# EAGLE schematic OLM-jee-128 (EAGLE 6.4)
ABBREV: jn6; PROJECT: JeeNode v6
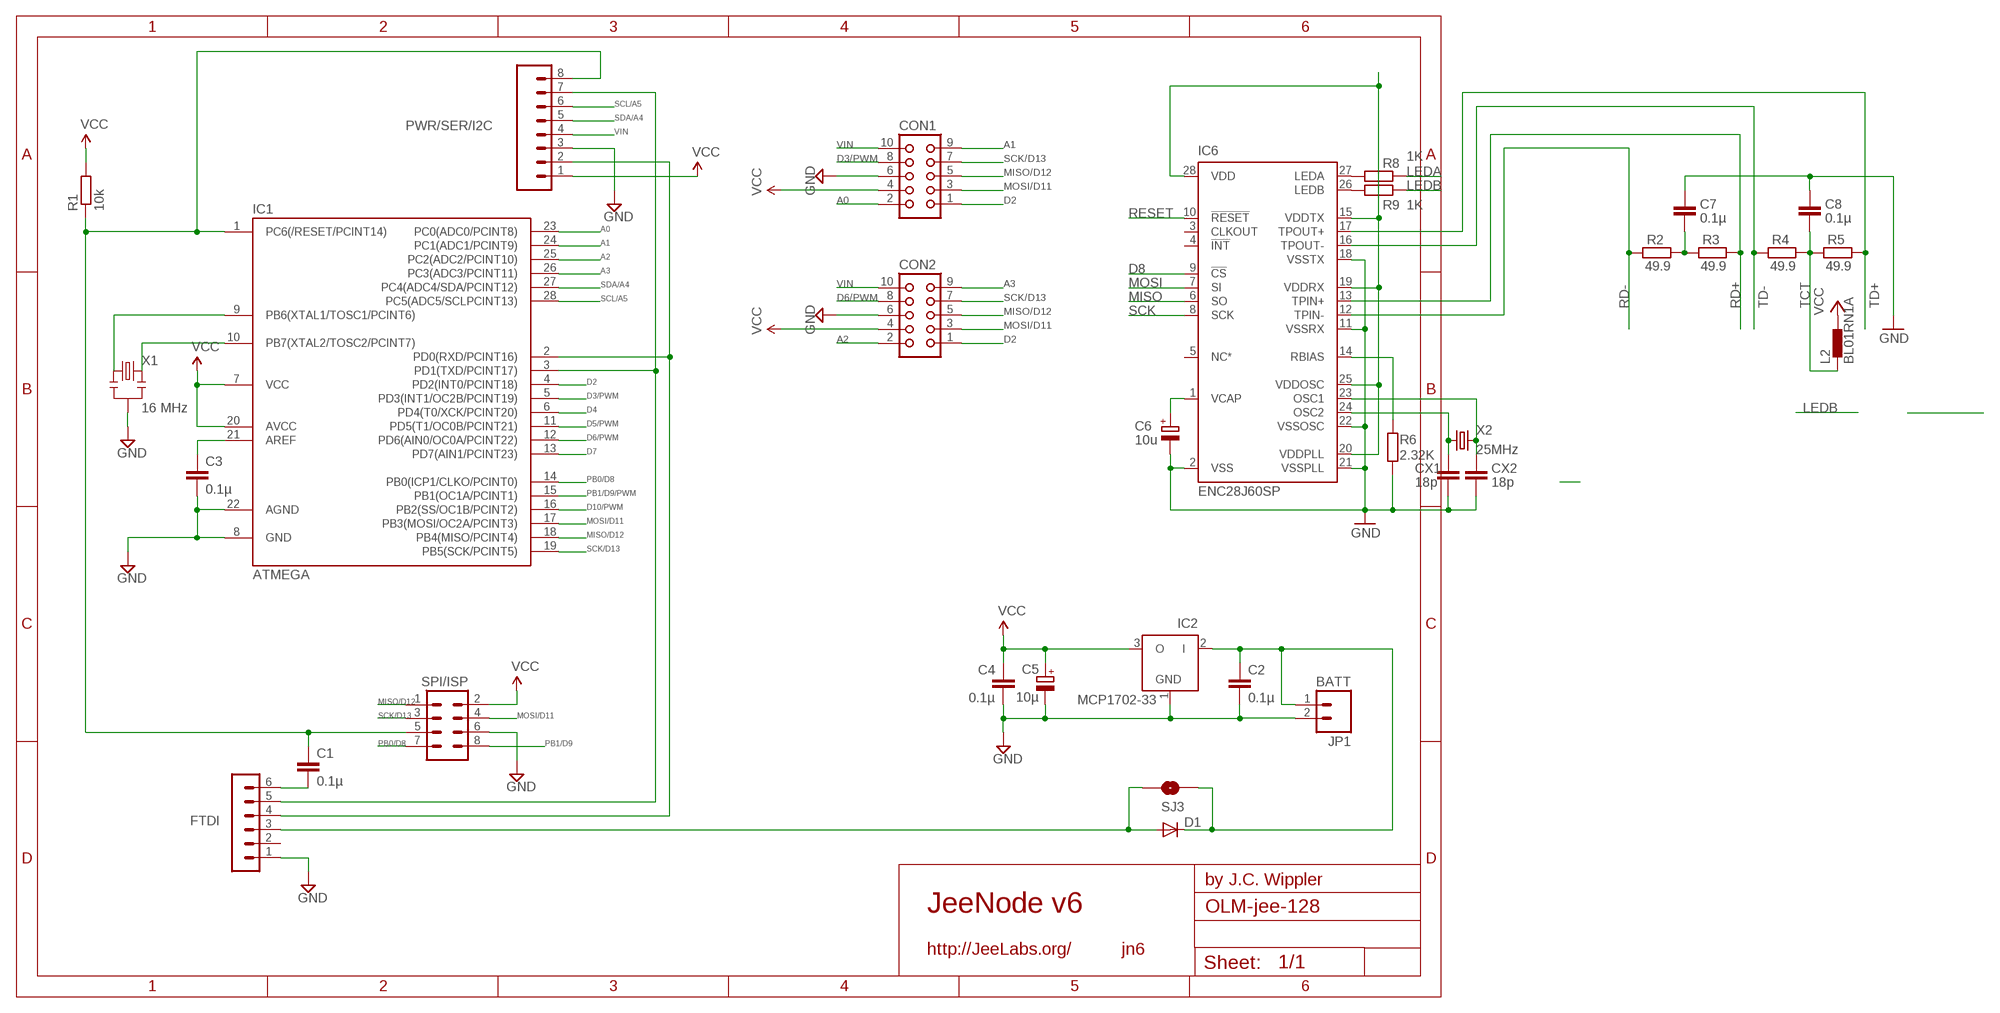
[diagram p0: schematic, sheet 1]

## Parts
C1  0.1µ  C-EU025-024X044  [C025-024X044]
C2  0.1µ  C-EU025-024X044  [C025-024X044]
C3  0.1µ  C-EU025-024X044  [C025-024X044]
C4  0.1µ  C-EU025-024X044  [C025-024X044]
C5  10µ  CPOL-EUE1.8-4  [E1,8-4]
C6  10u  CPOL-EUE1.8-4  [E1,8-4]
C7  0.1µ  C-EU025-024X044  [C025-024X044]
C8  0.1µ  C-EU025-024X044  [C025-024X044]
CON1  CON10L  [CON10L]
CON2  CON10L  [CON10L]
CX1  18p  C-EU025-024X044  [C025-024X044]
CX2  18p  C-EU025-024X044  [C025-024X044]
D1  DIODE-D-5  [D-5]
FTDI  FTDI  MA06-1  [MA06-1]
IC1  ATMEGA  ATMEGA48/88/168-PU  [DIL28-3]
IC2  MCP1702-33  MCP1702Z  [TO92]
IC6  ENC28J60SP  [DIL28-3]
JP1  BATT  M02LOCK_LONGPADS  [1X02_LOCK_LONGPADS]
L2  BL01RN1A  [BL01RN1A]
PWR/SER/I2C  M08  [1X08]
R1  10k  R-EU_0204/7  [0204/7]
R2  49.9  R-EU_0204/7  [0204/7]
R3  49.9  R-EU_0204/7  [0204/7]
R4  49.9  R-EU_0204/7  [0204/7]
R5  49.9  R-EU_0204/7  [0204/7]
R6  2.32K  R-EU_0204/7  [0204/7]
R8  1K  R-EU_0204/7  [0204/7]
R9  1K  R-EU_0204/7  [0204/7]
SJ3  SOLDERJUMPERTRACE  [SJ_2S-TRACE]
SV7  SPI/ISP  MA04-2  [MA04-2]
X1  16 MHz  RESONATORPTH  [RESONATOR-PTH]
X2  25MHz  CRYSTALHC49US  [HC49US]

## Nets
A0: CON1.2 IC1.23(PC0(ADC0/PCINT8))
A1: CON1.9 IC1.24(PC1(ADC1/PCINT9))
A2: CON2.2 IC1.25(PC2(ADC2/PCINT10))
A3: CON2.9 IC1.26(PC3(ADC3/PCINT11))
D2: CON1.1 CON2.1 IC1.4(PD2(INT0/PCINT18))
D3/PWM: CON1.8 IC1.5(PD3(INT1/OC2B/PCINT19))
D4: IC1.6(PD4(T0/XCK/PCINT20))
D5/PWM: IC1.11(PD5(T1/OC0B/PCINT21))
D6/PWM: CON2.8 IC1.12(PD6(AIN0/OC0A/PCINT22))
D7: IC1.13(PD7(AIN1/PCINT23))
D8: IC6.9(!CS)
D10/PWM: IC1.16(PB2(SS/OC1B/PCINT2))
GND [power]: C2.2 C3.2 C4.2 C5.- C6.- C7.1 C8.1 CON1.6 CON2.6 CX1.2 CX2.2 FTDI.1 IC1.8(GND) IC1.22(AGND) IC2.1(GND) IC6.2(VSS) IC6.11(VSSRX) IC6.18(VSSTX) IC6.21(VSSPLL) IC6.22(VSSOSC) JP1.2 PWR/SER/I2C.3 R6.2 SV7.6 X1.2
LEDA: R8.2
LEDB: R9.2
MISO: IC6.6(SO)
MISO/D12: CON1.5 CON2.5 IC1.18(PB4(MISO/PCINT4)) SV7.1
MOSI: IC6.7(SI)
MOSI/D11: CON1.3 CON2.3 IC1.17(PB3(MOSI/OC2A/PCINT3)) SV7.4
N$1: IC1.9(PB6(XTAL1/TOSC1/PCINT6)) X1.1
N$4: FTDI.5 IC1.3(PD1(TXD/PCINT17)) PWR/SER/I2C.7
N$7: FTDI.4 IC1.2(PD0(RXD/PCINT16)) PWR/SER/I2C.2
N$12 [power]: D1.A FTDI.3 SJ3.2
N$16 [power]: C2.1 D1.C IC2.2(I) JP1.1 SJ3.1
N$19: C3.1 IC1.21(AREF)
N$20: C1.2 FTDI.6
N$21: IC1.10(PB7(XTAL2/TOSC2/PCINT7)) X1.3
N$37: IC6.27(LEDA) R8.1
N$39: IC6.26(LEDB) R9.1
N$50: C6.+ IC6.1(VCAP)
N$51: IC6.14(RBIAS) R6.1
N$52: CX1.1 IC6.24(OSC2) X2.1
N$53: CX2.1 IC6.23(OSC1) X2.2
N$54: C7.2 R2.2 R3.1
PB0/D8: IC1.14(PB0(ICP1/CLKO/PCINT0)) SV7.7
PB1/D9: SV7.8
PB1/D9/PWM: IC1.15(PB1(OC1A/PCINT1))
RD+: IC6.13(TPIN+) R3.2
RD-: IC6.12(TPIN-) R2.1
RESET: IC6.10(!RESET)
RST: C1.1 IC1.1(PC6(/RESET/PCINT14)) PWR/SER/I2C.8 R1.1 SV7.5
SCK: IC6.8(SCK)
SCK/D13: CON1.7 CON2.7 IC1.19(PB5(SCK/PCINT5)) SV7.3
SCL/A5: IC1.28(PC5(ADC5/SCLPCINT13)) PWR/SER/I2C.6
SDA/A4: IC1.27(PC4(ADC4/SDA/PCINT12)) PWR/SER/I2C.5
TCT: C8.2 L2.1 R4.2 R5.1
TD+: IC6.17(TPOUT+) R5.2
TD-: IC6.16(TPOUT-) R4.1
VCC [power]: C4.1 C5.+ CON1.4 CON2.4 IC1.7(VCC) IC1.20(AVCC) IC2.3(O) IC6.15(VDDTX) IC6.19(VDDRX) IC6.20(VDDPLL) IC6.25(VDDOSC) IC6.28(VDD) L2.2 PWR/SER/I2C.1 R1.2 SV7.2
VIN: CON1.10 CON2.10 PWR/SER/I2C.4
Unconnected: FTDI.2 IC6.3(CLKOUT) IC6.4(!INT) IC6.5(NC*)

## Library data of the parts
C1-C4 C7 C8 CX1 CX2 = resistor:C-EU: CAPACITOR, European symbol
C5 C6 = resistor:CPOL-EU: POLARIZED CAPACITOR, European symbol
CON1 CON2 = con-harting:CON10L: CONNECTOR; OC_FARNELL: unknown; OC_NEWARK: unknown
D1 = diode:DIODE-: DIODE
FTDI = JeeLabs:MA06-1: PIN HEADER
IC1 = atmega8:ATMEGA48/88/168-PU
IC2 = JeeLabs:MCP1702: 200 mA, Low Power Low Dropout Voltage Regulator
IC6 = microchip:ENC28J60: Stand-Alone Ethernet Controller with SPI Interface Source: http://ww1.microchip.com/downloads/en/DeviceDoc/39662c.pdf; MF: MICROCHIP; MPN: ENC28J60/SP; OC_FARNELL: 1084619; OC_NEWARK: 96K3661
JP1 = SparkFun:M02: Header 2 Standard 2-pin 0.1" header. Use with straight break away headers (SKU : PRT-00116), right angle break away headers (PRT-00553), swiss pins (PRT-00743), machine pins (PRT-00117), and female headers (PRT-00115). Molex polarized connector foot print use with SKU : PRT-08233 with associated crimp pins and housings.
L2 = inductors:BL0: Noise Suppression Products/EMI Suppression Filters, Lead EMIFIL(R) Inductor Type Source: http://www.murata.com .. BL01RN1_DS.pdf
PWR/SER/I2C = SparkFun:M08: Header 8 Standard 8-pin 0.1" header. Use with straight break away headers (SKU : PRT-00116), right angle break away headers (PRT-00553), swiss pins (PRT-00743), machine pins (PRT-00117), and female headers (PRT-00115).
R1 = resistor:R-EU_: RESISTOR, European symbol
R2-R6 R8 R9 = rcl:R-EU_: RESISTOR, European symbol
SJ3 = SparkFun:SOLDERJUMPER: Solder Jumper Standard SMD solder jumper. Used to automate production. Two varients : Normally Open and Normally Closed are the same, but have different paste layers. NC will have a large amount of paste and should jumper during reflow.
SV7 = JeeLabs:MA04-2: PIN HEADER
X1 = SparkFun:RESONATOR: Resonator Small SMD resonator. This is the itty bitty 10/20MHz resonators with built in caps. CSTCE10M0G55 and CSTCE20M0V53. Footprint has been reviewed closely but hasn't been tested yet.
X2 = SparkFun:CRYSTAL: Crystals Various standard crystals. Proven footprints. Spark Fun Electronics SKU : COM-00534

## Net classes
0 default: width 0.305 mm, clearance 0.203 mm
1 power: width 0.813 mm, clearance 0.203 mm